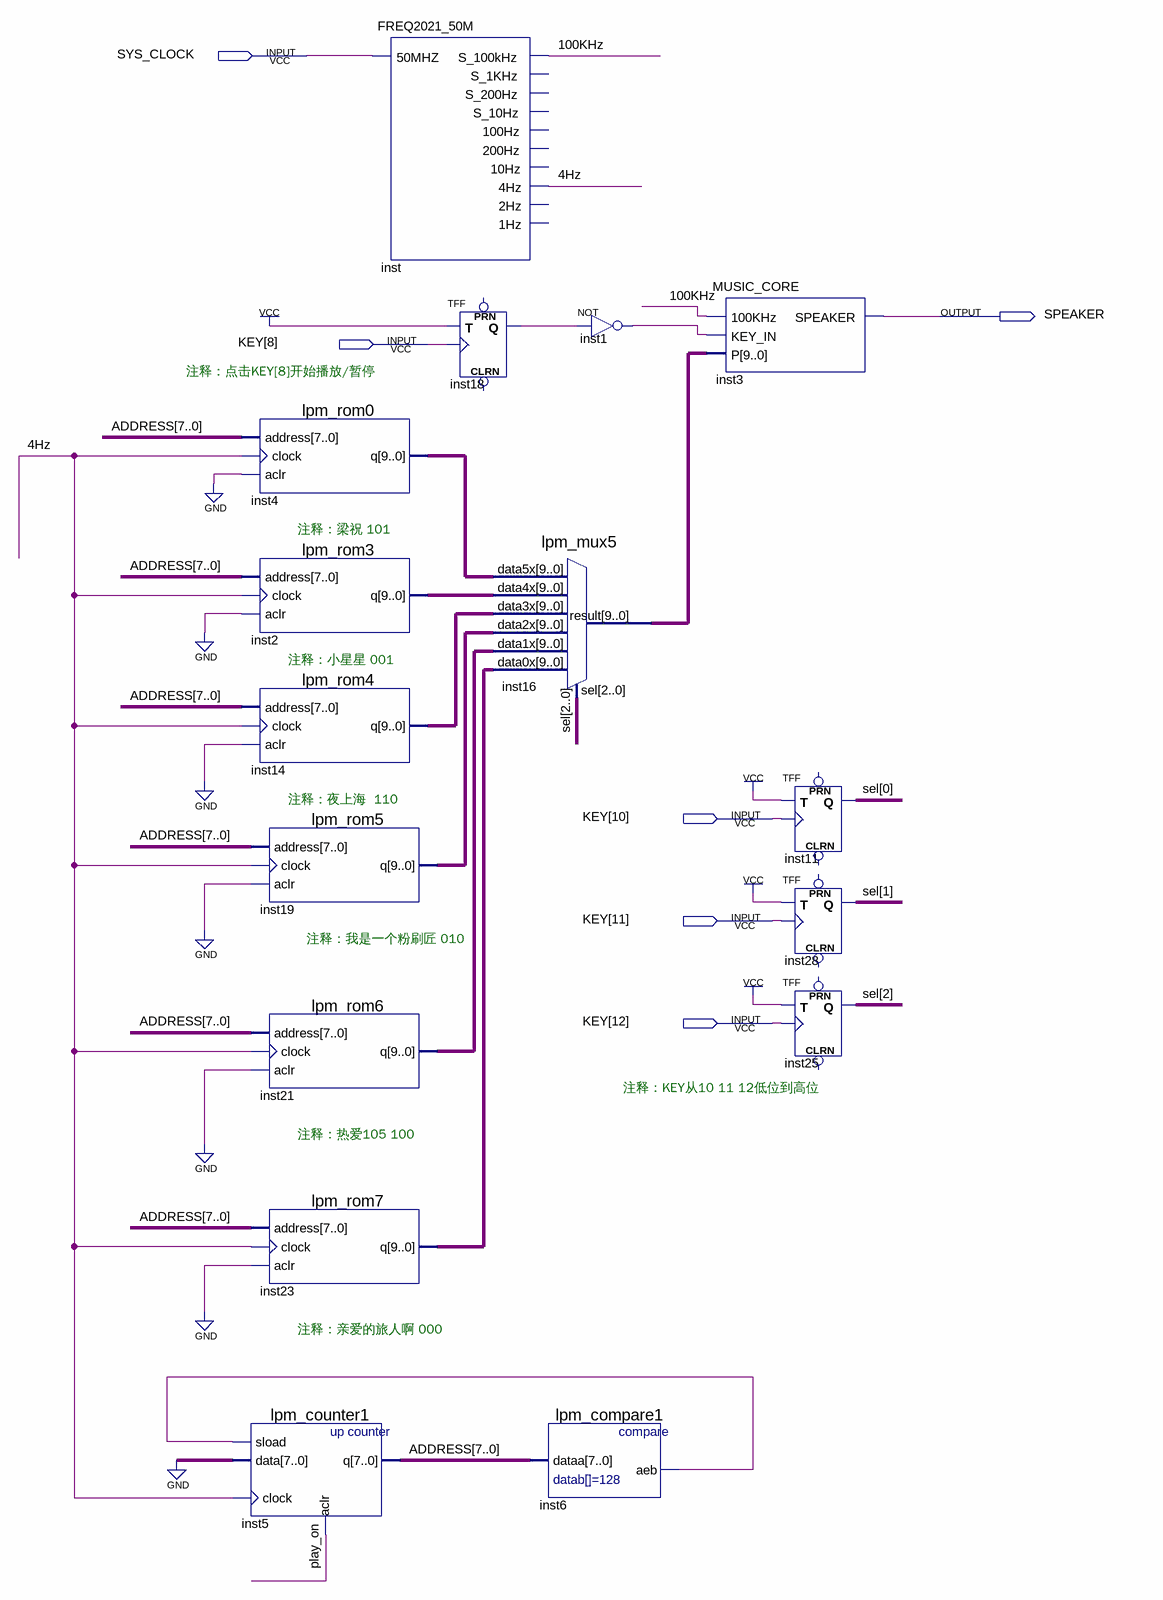
[diagram p0: schematic sheet]
// Quartus schematic autoplay.bdf as structural Verilog: 16 symbols, 6 pins
module autoplay (
  input  SYS_CLOCK,
  input  [12:8] KEY,
  output SPEAKER
);

  wire \4Hz , \100KHz , inst1_out, inst6_aeb, inst18_q, play_on;
  wire [2:0] sel;
  wire [7:0] ADDRESS;
  wire [9:0] inst2_q, inst4_q, inst14_q, inst16_result, inst19_q, inst21_q, inst23_q;

  lpm_rom0 inst4 (.address(ADDRESS), .clock(\4Hz ), .aclr(1'b0), .q(inst4_q));
  lpm_rom3 inst2 (.address(ADDRESS), .clock(\4Hz ), .aclr(1'b0), .q(inst2_q));
  lpm_rom4 inst14 (.address(ADDRESS), .clock(\4Hz ), .aclr(1'b0), .q(inst14_q));
  lpm_rom5 inst19 (.address(ADDRESS), .clock(\4Hz ), .aclr(1'b0), .q(inst19_q));
  lpm_rom6 inst21 (.address(ADDRESS), .clock(\4Hz ), .aclr(1'b0), .q(inst21_q));
  lpm_rom7 inst23 (.address(ADDRESS), .clock(\4Hz ), .aclr(1'b0), .q(inst23_q));
  lpm_counter1 inst5 (.sload(inst6_aeb), .data({8{1'b0}}), .clock(\4Hz ), .aclr(play_on), .q(ADDRESS));
  FREQ2021_50M inst (
    .\50MHZ (SYS_CLOCK), .S_100kHz(\100KHz ), .\4Hz (\4Hz ));  // open: S_1KHz, S_200Hz, S_10Hz, 100Hz, 200Hz, 10Hz, 2Hz, 1Hz
  TFF inst18 (.T(1'b1), .CLK(KEY[8]), .Q(inst18_q));  // open: PRN, CLRN
  lpm_mux5 inst16 (
    .data5x(inst4_q), .data4x(inst2_q), .data3x(inst14_q), .data2x(inst19_q), .data1x(inst21_q),
    .data0x(inst23_q), .sel(sel), .result(inst16_result));
  not inst1 (inst1_out, inst18_q);
  lpm_compare1 inst6 (.dataa(ADDRESS), .aeb(inst6_aeb));
  MUSIC_CORE inst3 (.\100KHz (\100KHz ), .KEY_IN(inst1_out), .P(inst16_result), .SPEAKER(SPEAKER));
  TFF inst11 (.T(1'b1), .CLK(KEY[10]), .Q(sel[0]));  // open: PRN, CLRN
  TFF inst28 (.T(1'b1), .CLK(KEY[11]), .Q(sel[1]));  // open: PRN, CLRN
  TFF inst25 (.T(1'b1), .CLK(KEY[12]), .Q(sel[2]));  // open: PRN, CLRN

  // Notes on the sheet:
  //   注释：点击KEY[8]开始播放/暂停
  //   注释：梁祝 101
  //   注释：小星星 001
  //   注释：夜上海  110
  //   注释：我是一个粉刷匠 010
  //   注释：KEY从10 11 12低位到高位
  //   注释：热爱105 100
  //   注释：亲爱的旅人啊 000
endmodule
